# Altium schematic sheet 1n4148.schdoc
size 49 x 28 mm
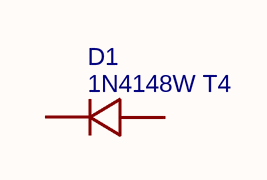
[diagram p0: 1n4148.schdoc]

## Parts
D1  1N4148W T4  [SOD-123_L2.8-W1.8-LS3.7-RD]

## Nets

Not connected (* = marked no-connect by the designer): D1 1(K) 2(A)

## Library data of the parts
D1 = 1N4148W T4: BOM_Manufacturer: CJ; Contributor: 立创EDA官方封装库; BOM_Supplier: LCSC; BOM_Manufacturer Part: 1N4148W T4; BOM_Supplier Part: C2099; BOM_JLCPCB Part Class: Extended Part; spicePre: D; spiceSymbolName: 1N4148W T4